# Altium schematic sheet I2C_Repeater.SchDoc
size Letter; SheetNumber: 1; SheetTotal: 1
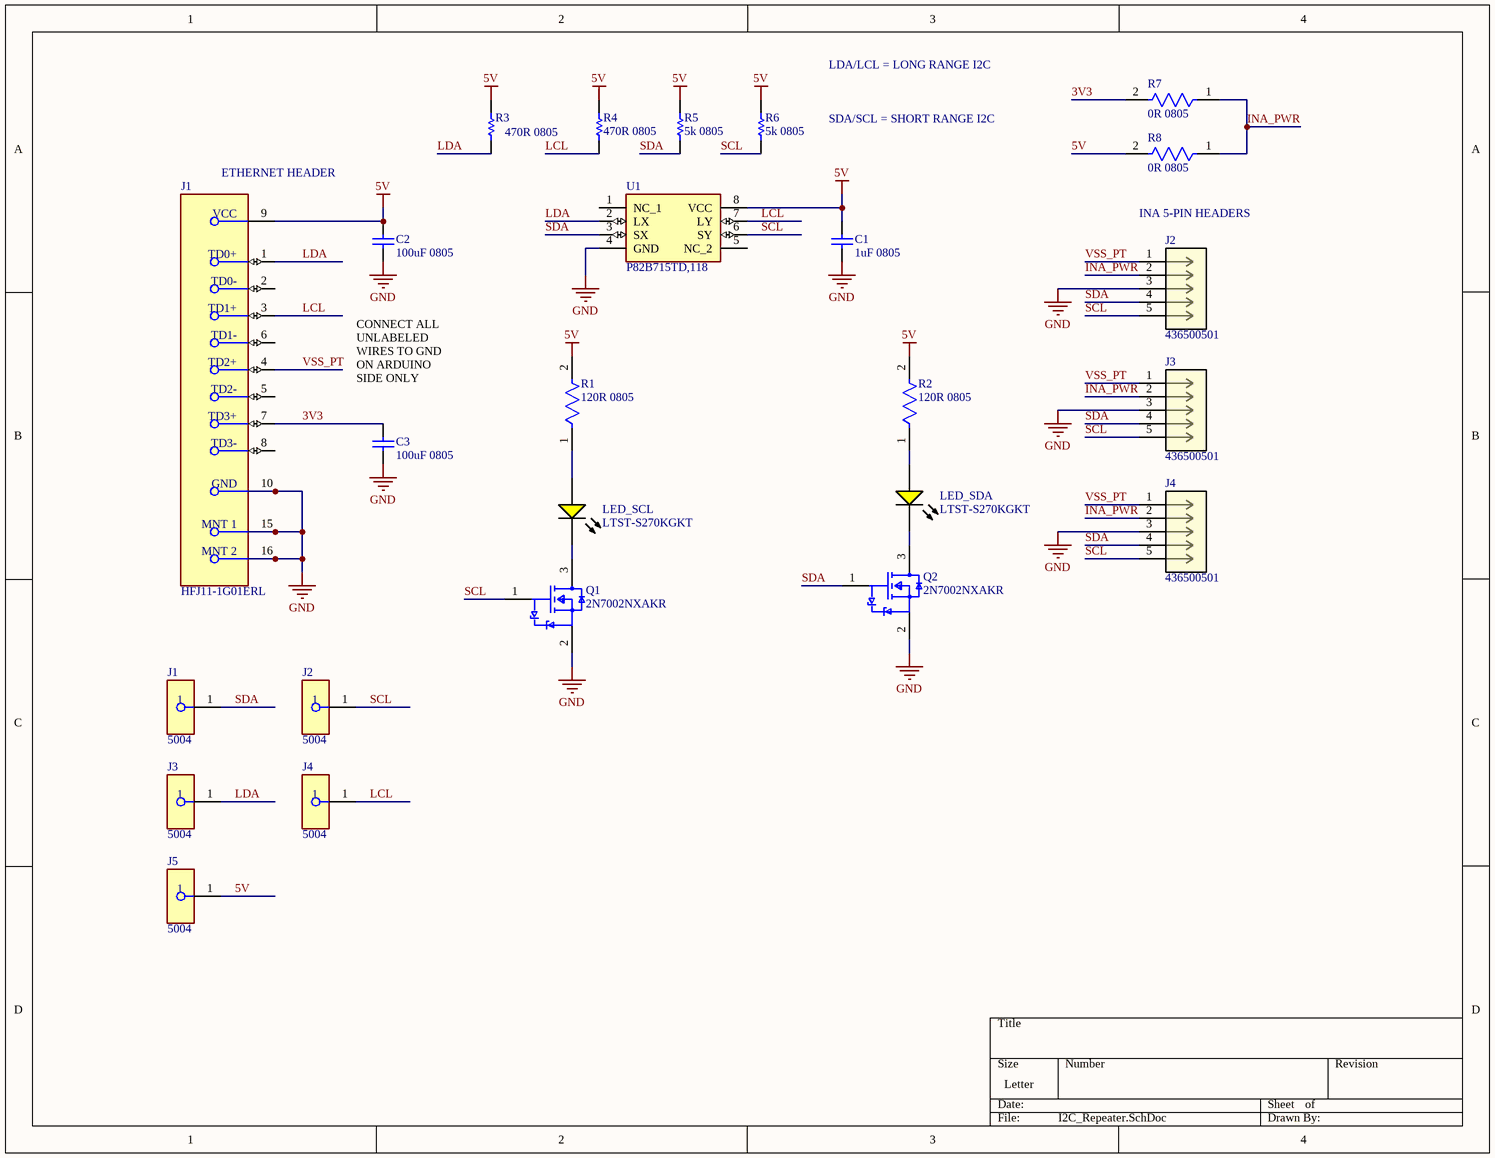
[diagram p0: I2C_Repeater.SchDoc]

## Parts
(Parts that share a designator on the sheet are numbered #1, #2 ... from top to bottom, then left to right.)
C1  1uF 0805  [CAPC2013X135X45LL10T25]
C2  100uF 0805  [CAPC2013X135X45LL10T25]
C3  100uF 0805  [CAPC2013X135X45LL10T25]
J1#1  HFJ11-1G01ERL  [FP-HFJ11-1G01ERL-MFG]
J1#2  5004  [FP-5004-MFG]
J2#1  436500501  [CON_436500501_MOL]
J2#2  5004  [FP-5004-MFG]
J3#1  436500501  [CON_436500501_MOL]
J3#2  5004  [FP-5004-MFG]
J4#1  436500501  [CON_436500501_MOL]
J4#2  5004  [FP-5004-MFG]
J5  5004  [FP-5004-MFG]
LED_SCL  LTST-S270KGKT  [AVAG-HSMX-C190_V]
LED_SDA  LTST-S270KGKT  [AVAG-HSMX-C190_V]
Q1  2N7002NXAKR  [FP-SOT23-IPC_B]
Q2  2N7002NXAKR  [FP-SOT23-IPC_B]
R1  120R 0805  [FP-CRCW0805-e3-IPC_C]
R2  120R 0805  [FP-CRCW0805-e3-IPC_C]
R3  470R 0805  [RESC2013X50X30ML20T20]
R4  470R 0805  [RESC2013X50X30ML20T20]
R5  5k 0805  [RESC2013X50X30ML20T20]
R6  5k 0805  [RESC2013X50X30ML20T20]
R7  0R 0805  [FP-CRCW0805-e3-IPC_B]
R8  0R 0805  [FP-CRCW0805-e3-IPC_B]
U1  P82B715TD,118  [SOIC127P600X175-8N]

## Nets
5V: C1.2 C2.2 J1#1.9(VCC) J5.1 R1.2 R2.2 R3.2 R4.2 R5.2 R6.2 R8.2 U1.8(VCC)
GND: C1.1 C2.1 C3.1 J1#1.10(GND) J1#1.15(MNT_1) J1#1.16(MNT_2) J2#1.3 J3#1.3 J4#1.3 Q1.2(S) Q2.2(S) U1.4(GND)
3V3: C3.2 J1#1.7(TD3+) R7.2
INA_PWR: J2#1.2 J3#1.2 J4#1.2 R7.1 R8.1
LCL: J1#1.3(TD1+) J4#2.1 R4.1 U1.7(LY)
LDA: J1#1.1(TD0+) J3#2.1 R3.1 U1.2(LX)
SCL: J2#1.5 J2#2.1 J3#1.5 J4#1.5 Q1.1(G) R6.1 U1.6(SY)
SDA: J1#2.1 J2#1.4 J3#1.4 J4#1.4 Q2.1(G) R5.1 U1.3(SX)
VSS_PT: J1#1.4(TD2+) J2#1.1 J3#1.1 J4#1.1
NetLED_SCL_1: LED_SCL.1(A) R1.1
NetLED_SCL_2: LED_SCL.2(K) Q1.3(D)
NetLED_SDA_1: LED_SDA.1(A) R2.1
NetLED_SDA_2: LED_SDA.2(K) Q2.3(D)

Not connected (* = marked no-connect by the designer): J1#1 2(TD0-) 5(TD2-) 6(TD1-) 8(TD3-); U1 1(NC_1) 5(NC_2)

## Notes on the sheet
- LDA/LCL = LONG RANGE I2C
- SDA/SCL = SHORT RANGE I2C
- (near J1#1) ETHERNET HEADER
- INA 5-PIN HEADERS
- CONNECT ALL UNLABELED WIRES TO GND ON ARDUINO SIDE ONLY

## Library data of the parts
C1-C3 = CMP-1036-04761-2: Manufacturer: Murata; Part Number: GRM21BR71H105KA12L
J1#1 = CMP-218039-000001-2: Conn RJ-45 F 8 POS 2.54mm Solder RA Thru-Hole 10 Terminal 1 Port; Manufacturer: HALO; Pitch: 1.27mm; Number Of Contacts: 8; Shielding: true; Conn Orientation: Horizontal; Conn Gender: Female; Is Female: yes; Manufacturer Part Number: HFJ11-1G01ERL; Device Class L1: Connectors; Device Class L2: Modular / Ethernet Connectors; Category: Conn; Automotive: No; ComponentLink2Description: Datasheet; Device Class L3: unset; Lead Free: Yes; Temperature Range Low: 0°C; Mouser Description: Conn RJ-45 F 8 POS 2.54mm Solder RA Thru-Hole 10 Terminal 1 Port; Temperature: 0°C to +70°C; Temperature Range High: +70°C; Package: 0; Contact Material: Gold; Height: 0.624inch; ComponentLink2URL: https://www.haloelectronics.com/pdf/fastjack-gigabit.pdf; Octopart: https://octopart.com/hfj11-1g01erl-halo-4052130; RoHS: TRUE
J1#2 J2#2 J3#2 J4#2 J5 = CMP-2000-05575-2: PC TEST POINT MINIATURE YELLOW; Manufacturer: Keystone; Number Of Contacts: 1; Is Female: yes; Device Class L1: Connectors; Manufacturer Part Number: 5004; Digikey Description: PC TEST POINT MINIATURE YELLOW; ComponentLink2URL: https://www.keyelco.com/product-pdf.cfm?p=1313; Lead Free: Yes; ComponentLink2Description: Datasheet; Category: Conn; Height: 4.72mm; Octopart: https://octopart.com/5004-keystone-28591; Mouser Description: TEST POINT PC MINI .040"D YELLOW; Device Class L3: unset; Contact Material: Silver; Package: 5004; Automotive: No; Device Class L2: unset; RoHS: TRUE
J2#1 J3#1 J4#1 = 436500501: No Description Available; Mfr_Name: Molex Connector Corporation; Copyright: Copyright (C) 2023 Ultra Librarian. All rights reserved.; Manufacturer_Part_Number: 436500501; RefDes: RefDes; Type: DEV
LED_SCL LED_SDA = CMP-1744-00003-1: LED Uni-Color Yellow, 65 mW, 20 mA, -40 to 85 degC, 2-Pin SMD, RoHS, Tape and Reel; Tolerance: 1%; Voltage Rating: 50 V; Power Rating: 100 mW; Case\Package: 0603; Resistance: 390 Ohm; Min Operating Temperature: -55 degC; Length: 1.6 mm; ComponentLink3Description: Package Specification; Mount: Surface Mount; PackageReference: HSMX-C190; ComponentLink2Description: Datasheet; DatasheetVersion: Mar-12; Case Code (Metric): 1608; Pins: 2; Package Quantity: 5000; ComponentLink2URL: http://docs.avagotech.com/docs/AV02-0551EN; ComponentLink1Description: Manufacturer URL; RoHSCompliant: true; Packaging: Tape and Reel; PackageDescription: 2-Pin Surface Mount Device, Body 1.6 x 0.8 mm, Height 0.9 mm; REACH SVHC: No SVHC; ComponentLink3URL: http://www.fairchildsemi.com/dwg/MA/MA03D.pdf; Voltage Rating (DC): 50 V; Width: 0.8 mm; ComponentLink1URL: http://www.avagotech.com/; Max Operating Temperature: 155 degC; Case Code (Imperial): 0603; Height: 0.45 mm
Q1 Q2 = CMP-14409-000026-2: 2N7002NXAK/SOT23/TO-236AB
R1 R2 = CMP-02407-007854-1: RES Thick Film, 120Ω, 1%, 0.125W, 100ppm/°C, 0805; Voltage Rating (DC): 150V; Max Power Dissipation: 125mW; Height: 0.45mm; Min Operating Temperature: -55°C; Packaging: Tape and Reel; Resistance: 120R; Package Quantity: 10; Width: 1.25mm; Weight: 0.000194oz; Termination: SMD/SMT; Mount: Surface Mount; Tolerance: 1%; Military Standard: Not; Max Operating Temperature: 155°C; Lead Free: Lead Free; Number of Terminations: 2; Radiation Hardening: No; Temperature Coefficient: 100ppm/°C; Length: 2mm; Case/Package: 0805; Voltage Rating: 150V; Case Code (Metric): 2012; Case Code (Imperial): 0805; Features: Automotive AEC-Q200; Composition: Thick Film; Contact Plating: Tin; Power Rating: 125mW; Depth: 1.25mm
R3-R6 = CMP-2001-04239-1: Part Number: CRCW08055K00FKTA; Manufacturer: Vishay Dale
R7 R8 = CMP-2001-04897-2: RES Thick Film, 0Ω, 0.125W, 0805; Power Rating: 125mW; Resistance: 0mR; Voltage Rating: 150V; Length: 2mm; Width: 0.049inch; Weight: 0.000194oz; Composition: Thick Film; Contact Plating: Tin; Max Power Dissipation: 125mW; Min Operating Temperature: -55°C; Packaging: Tape and Reel; Number of Terminations: 2; Package Quantity: 10000; Case Code (Imperial): 0805; Military Standard: Not; Height: 0.02inch; Features: Automotive AEC-Q200; Depth: 1.25mm; Radiation Hardening: No; Lead Free: Lead Free; Case Code (Metric): 2012; Case/Package: 0805; Voltage Rating (DC): 150V; Termination: SMD/SMT; Max Operating Temperature: 155°C
U1 = P82B715TD,118: Undefined or Miscellaneous; Manufacturer_Name: NXP; Datasheet Link: http://www.nxp.com/docs/en/data-sheet/P82B715.pdf; Height: 1.75mm; Manufacturer_Part_Number: P82B715TD,118; Mouser Part Number: 771-P82B715TD118; Mouser Price/Stock: https://www.mouser.co.uk/ProductDetail/NXP-Semiconductors/P82B715TD118?qs=LOCUfHb8d9tYdoWkpYDXXg%3D%3D; Arrow Part Number: P82B715TD,118; Arrow Price/Stock: https://www.arrow.com/en/products/p82b715td118/nxp-semiconductors?region=nac